# Altium schematic sheet Top Level.SchDoc
size A4; SheetNumber: 1; SheetTotal: 8
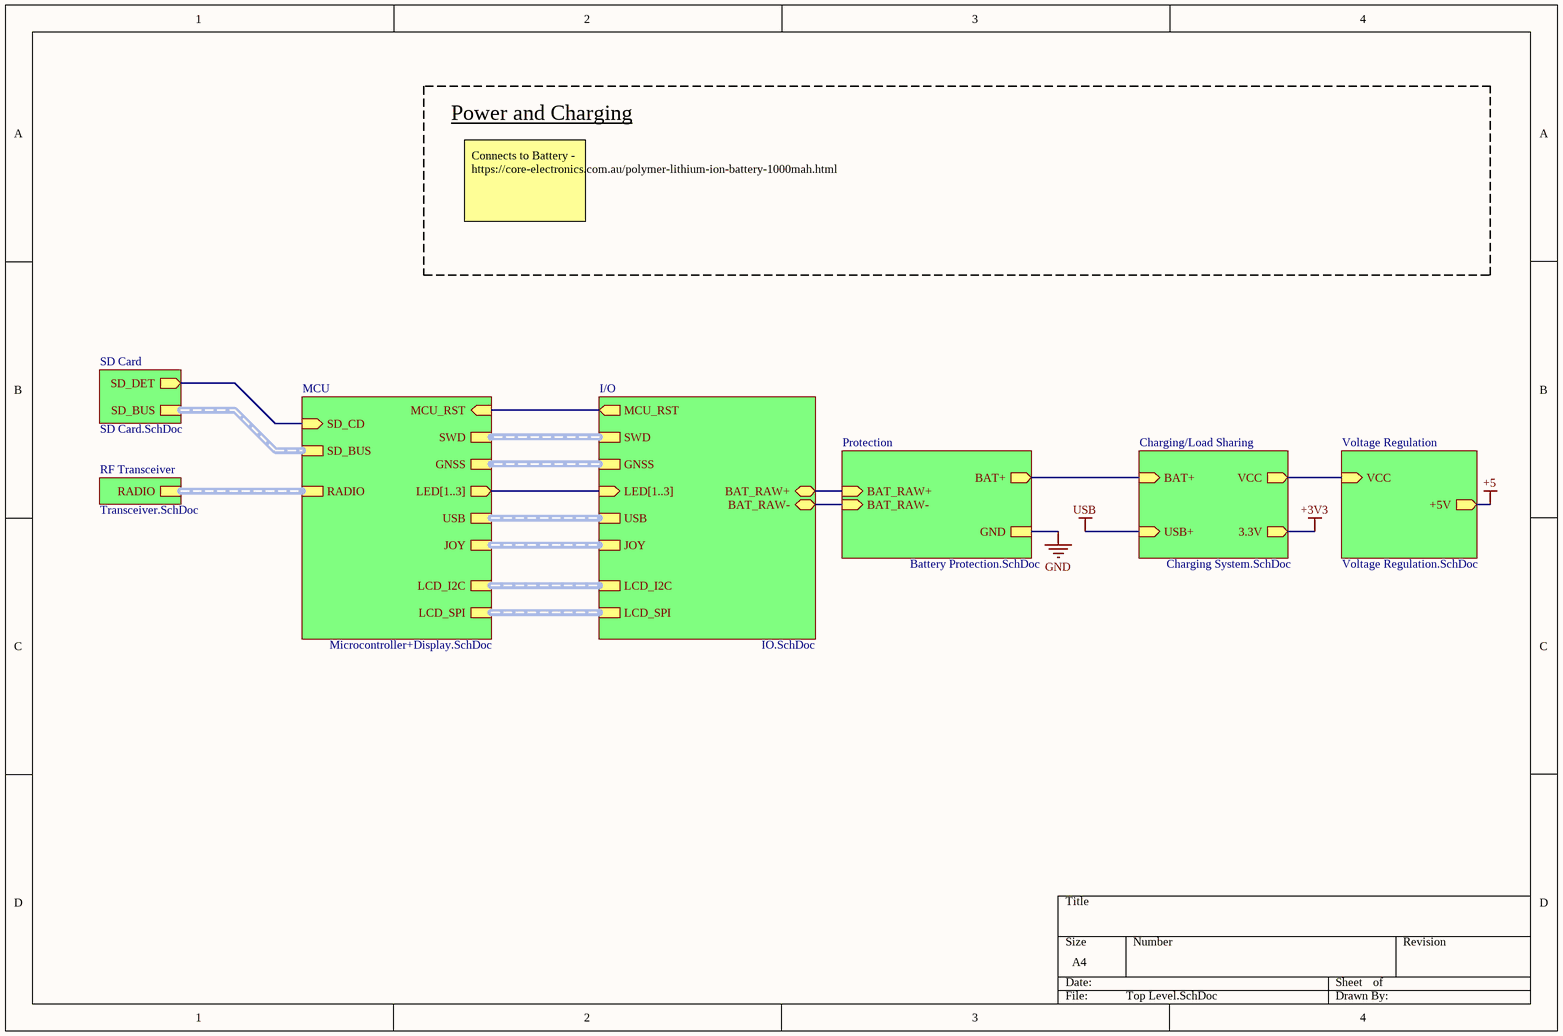
[diagram p0: Top Level.SchDoc]

## Sub-sheets
Charging/Load Sharing = Charging System.SchDoc: USB+ (in), BAT+ (in), VCC (out), 3.3V (out)
I/O = IO.SchDoc: USB (harness USB), SWD (harness SWD), JOY (harness JOY), LED[1..3] (in), MCU_RST (out), LCD_SPI (harness LCD_SPI), LCD_I2C (harness LCD_I2C), GNSS (harness GNSS), BAT_RAW+ (bidir), BAT_RAW- (bidir)
MCU = Microcontroller+Display.SchDoc: SD_BUS (harness SD_BUS), MCU_RST (in), SWD (harness SWD), RADIO (harness RADIO), USB (harness USB), JOY (harness JOY), SD_CD (in), LCD_I2C (harness LCD_I2C), LCD_SPI (harness LCD_SPI), LED[1..3] (out), GNSS (harness GNSS)
Protection = Battery Protection.SchDoc: BAT_RAW+ (in), BAT_RAW- (in), BAT+ (out), GND
RF Transceiver = Transceiver.SchDoc: RADIO (harness RADIO)
SD Card = SD Card.SchDoc: SD_BUS (harness SD_BUS), SD_DET (out)
Voltage Regulation = Voltage Regulation.SchDoc: VCC (in), +5V (out)

## Nets
+3V3: sheet Charging/Load Sharing/3.3V
+5: sheet Voltage Regulation/+5V
GND: sheet Protection/GND
USB: sheet Charging/Load Sharing/USB+
(unnamed): sheet Voltage Regulation/VCC, sheet Charging/Load Sharing/VCC
(unnamed): sheet I/O/MCU_RST, sheet MCU/MCU_RST
(unnamed): sheet I/O/BAT_RAW+, sheet Protection/BAT_RAW+
(unnamed): sheet I/O/BAT_RAW-, sheet Protection/BAT_RAW-
(unnamed): sheet MCU/SD_CD, sheet SD Card/SD_DET
(unnamed): sheet Protection/BAT+, sheet Charging/Load Sharing/BAT+

## Buses and harness runs
bus sheet I/O/LED[1..3] = sheet MCU/LED[1..3]
harness sheet I/O/GNSS = sheet MCU/GNSS
harness sheet I/O/JOY = sheet MCU/JOY
harness sheet I/O/LCD_I2C = sheet MCU/LCD_I2C
harness sheet I/O/LCD_SPI = sheet MCU/LCD_SPI
harness sheet I/O/SWD = sheet MCU/SWD
harness sheet I/O/USB = sheet MCU/USB
harness sheet MCU/RADIO = sheet RF Transceiver/RADIO
harness sheet MCU/SD_BUS = sheet SD Card/SD_BUS

## Notes on the sheet
- Power and Charging
- Connects to Battery - https://core-electronics.com.au/polymer-lithium-ion-battery-1000mah.html